# EAGLE design SAML10_DEV_2 (EAGLE 9.6.2)
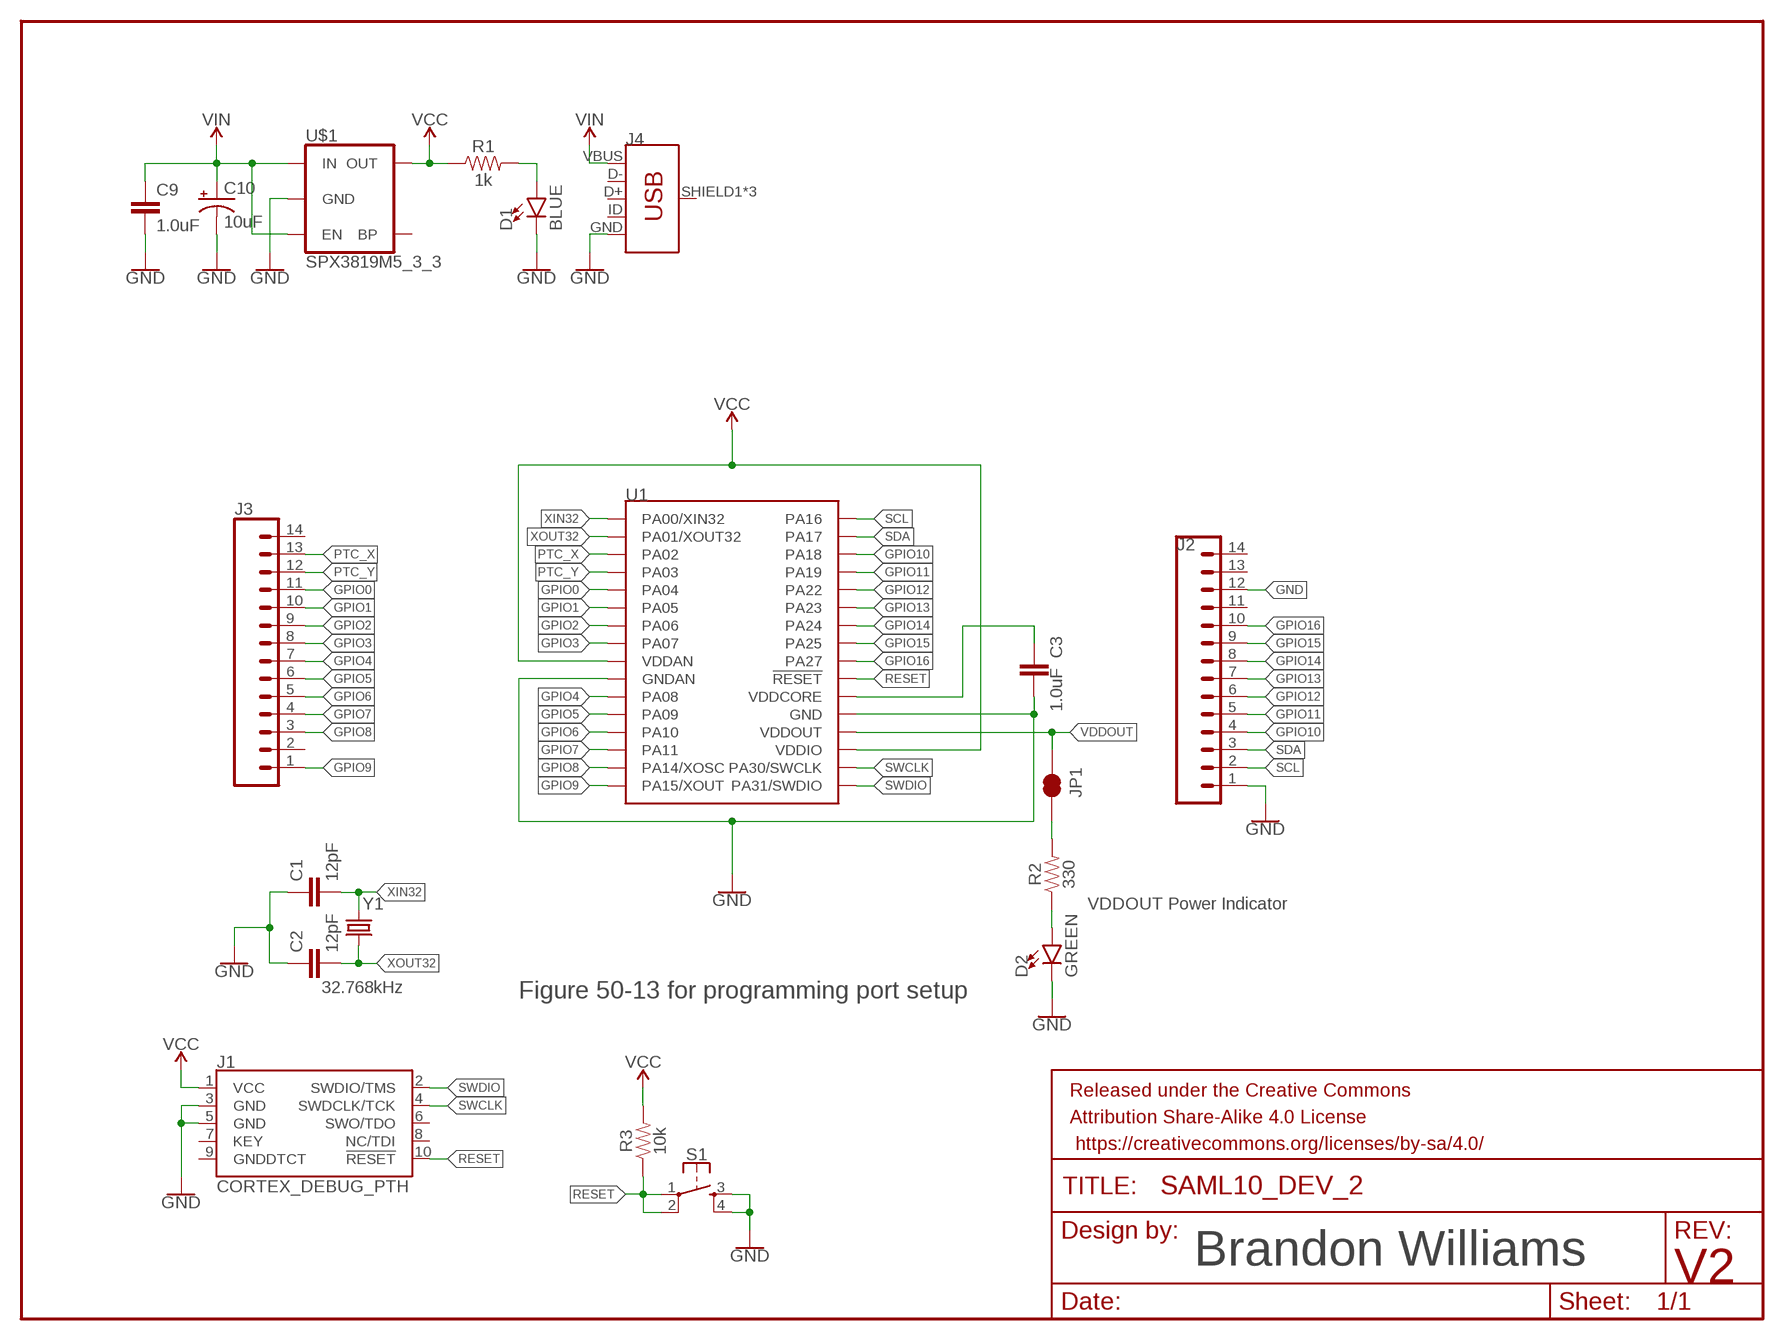
[diagram p0: schematic, sheet 1]

## Parts
C1  12pF  12PF-0603-50V-5%  [0603]
C2  12pF  12PF-0603-50V-5%  [0603]
C3  1.0uF  1.0UF-0603-16V-10%  [0603]
C9  1.0uF  1.0UF-0402-16V-10%  [0402]
C10  10uF  10UF-POLAR-0603-6.3V-20%(TANT)  [0603-POLAR]
D1  BLUE  LED-BLUE0603  [LED-0603]
D2  GREEN  LED-GREEN0603  [LED-0603]
FRAME1  FRAME-LETTERNO_PACKAGE  [DUMMY]
J1  CORTEX_DEBUG_PTH  [2X5-PTH-1.27MM]
J2  CONN_14  [1X14]
J3  CONN_14  [1X14]
J4  USB_MICRO-BREDUCED_PASTE  [USB-B-MICRO-SMD_RED_PASTE]
JP1  JUMPER-SMT_2_NC_TRACE_NO-SILK  [SMT-JUMPER_2_NC_TRACE_NO-SILK]
R1  1k  1KOHM-0603-1/10W-1%  [0603]
R2  330  330OHM-0603-1/10W-1%  [0603]
R3  10k  10KOHM-0603-1/10W-1%  [0603]
S1  MOMENTARY-SWITCH-SPST-2-SMD-4.6X2.8MM  [TACTILE_SWITCH_SMD_4.6X2.8MM]
U1  SAML10  [ATSAML10E15A-MU-ND]
U$1  SPX3819M5_3_3  V_REG_SPX3819-SOT23-5  [SOT23-5]
Y1  32.768kHz  CRYSTAL-32.768KHZSMD-3.2X1.5  [CRYSTAL-SMD-3.2X1.5MM]

## Nets
GND: C1.1 C2.1 C3.2 C9.2 C10.- D1.C D2.C J1.3(GND) J1.5(GND) J2.1 J2.12 J4.GND S1.3 S1.4 U1.P$10(GNDAN) U1.P$28(GND) U$1.2(GND)
GPIO0: J3.11 U1.P$5(PA04)
GPIO1: J3.10 U1.P$6(PA05)
GPIO2: J3.9 U1.P$7(PA06)
GPIO3: J3.8 U1.P$8(PA07)
GPIO4: J3.7 U1.P$11(PA08)
GPIO5: J3.6 U1.P$12(PA09)
GPIO6: J3.5 U1.P$13(PA10)
GPIO7: J3.4 U1.P$14(PA11)
GPIO8: J3.3 U1.P$15(PA14/XOSC)
GPIO9: J3.1 U1.P$16(PA15/XOUT)
GPIO10: J2.4 U1.P$19(PA18)
GPIO11: J2.5 U1.P$20(PA19)
GPIO12: J2.6 U1.P$21(PA22)
GPIO13: J2.7 U1.P$22(PA23)
GPIO14: J2.8 U1.P$23(PA24)
GPIO15: J2.9 U1.P$24(PA25)
GPIO16: J2.10 U1.P$25(PA27)
N$1: JP1.2 R2.2
N$2: D2.A R2.1
N$3: C3.1 U1.P$27(VDDCORE)
N$25: D1.A R1.2
PTC_X: J3.13 U1.P$3(PA02)
PTC_Y: J3.12 U1.P$4(PA03)
RESET: J1.10(!RESET) R3.1 S1.1 S1.2 U1.P$26(!RESET)
SCL: J2.2 U1.P$17(PA16)
SDA: J2.3 U1.P$18(PA17)
SWCLK: J1.4(SWDCLK/TCK) U1.P$31(PA30/SWCLK)
SWDIO: J1.2(SWDIO/TMS) U1.P$32(PA31/SWDIO)
VCC: J1.1(VCC) R1.1 R3.2 U1.P$9(VDDAN) U1.P$30(VDDIO) U$1.5(OUT)
VDDOUT: JP1.1 U1.P$29(VDDOUT)
VIN: C9.1 C10.+ J4.VBUS U$1.1(IN) U$1.3(EN)
XIN32: C1.2 U1.P$1(PA00/XIN32) Y1.P$1
XOUT32: C2.2 U1.P$2(PA01/XOUT32) Y1.P$2
Unconnected: J1.6(SWO/TDO) J1.7(KEY) J1.8(NC/TDI) J1.9(GNDDTCT) J2.11 J2.13 J2.14 J3.2 J3.14 J4.D+ J4.D- J4.ID J4.SHIELD1(SHIELD) J4.SHIELD2(SHIELD) J4.SHIELD3(SHIELD) U$1.4(BP)

## Notes on the sheet
- VDDOUT Power Indicator
- Figure 50-13 for programming port setup
- Brandon Williams
- V2

## Library data of the parts
C1 C2 = SparkFun-Capacitors:12PF: 12pF ceramic capacitors A capacitor is a passive two-terminal electrical component used to store electrical energy temporarily in an electric field.; PROD_ID: CAP-09137
C3 = SparkFun-Capacitors:1.0UF: 1µF ceramic capacitors A capacitor is a passive two-terminal electrical component used to store electrical energy temporarily in an electric field.; PROD_ID: CAP-00868
C9 = SparkFun-Capacitors:1.0UF: 1µF ceramic capacitors A capacitor is a passive two-terminal electrical component used to store electrical energy temporarily in an electric field.; PROD_ID: CAP-12417
C10 = SparkFun-Capacitors:10UF-POLAR: 10.0µF polarized capacitors A capacitor is a passive two-terminal electrical component used to store electrical energy temporarily in an electric field.; PROD_ID: CAP-13210
D1 = SparkFun-LED:LED-BLUE: Blue SMD LED Used in manufacturing of various products at SparkFun Packages: 0603 - SMD 0603 package [Product Link] <http://www.digikey.com/product-detail/en/SMLE12BC7TT86/511-1589-2-ND/1641808> 1206 - SMD1206 package [Product Link] <http://www.digikey.com/product-detail/en/lite-on-inc/LTST-C150TBKT/160-1643-1-ND/573584> SparkFun Products: ESP8266 Thing-Dev Board <https://www.sparkfun.com/products/13711> RedBoard <https://www.sparkfun.com/products/12757>; PROD_ID: DIO-08575
D2 = SparkFun-LED:LED-GREEN: Green SMD LED Used in manufacturing of various products at SparkFun Packages: 0603 - SMD 0603 package [Product Link] <http://www.futureelectronics.com/en/technologies/semiconductors/optoelectronics/leds/Pages/9894312-LTST-C190GKT.aspx?CrossPart=HSMG-C190&IM=0> LilyPad 1206 - SMD1206 LilyPad package [Product Link] <http://www.futureelectronics.com/en/Technologies/Product.aspx?ProductID=IN150NGHARVATEKCORPORATION2049943&IM=0> 1206 - SMD1206 package [Product Link] <http://www.futureelectronics.com/en/technologies/semiconductors/optoelectronics/leds/Pages/8315665-LTST-C150KGKT.aspx?IM=0> 1206 Bottom Mount -SMD 1206 Bottom Mount [Product Link] <http://www.digikey.com/product-detail/en/lite-on-inc/LTST-C230KGKT/160-1456-1-ND/386854> SparkFun Products: Pro Mini 328 -5V <https://www.sparkfun.com/products/821> RedBoard <https://www.sparkfun.com/products/12757> MP3 Trigger <https://www.sparkfun.com/products/13720> Makey Makey <https://www.sparkfun.com/products/11076>; PROD_ID: DIO-00821
FRAME1 = SparkFun-Aesthetics:FRAME-LETTER: Schematic Frame - Letter Standard 8.5x11 US Letter frame; DESIGNER: Nobody; VERSION: v01
J1 = SparkFun-Connectors:CORTEX_DEBUG: Cortex Debug Connector - 10 pin Supports JTAG debug, Serial Wire debug, and Serial Wire Viewer. PTH and SMD connector options available. General Connector Information <http://infocenter.arm.com/help/topic/com.arm.doc.faqs/attached/13634/cortex_debug_connectors.pdf> Products: PTH Connector <http://www.digikey.com/product-detail/en/cnc-tech/3220-10-0100-00/1175-1627-ND/3883661> -via Digi-Key SparkFun PSoc <https://www.sparkfun.com/products/13229> SparkFun T <https://www.sparkfun.com/products/13810>
J2 J3 = SparkFun-Connectors:CONN_14: Multi connection point. Often used as Generic Header-pin footprint for 0.1 inch spaced/style header connections On any of the 0.1 inch spaced packages, you can populate with these: Break Away Headers - Straight <https://www.sparkfun.com/products/116> (PRT-00116) Break Away Male Headers - Right Angle <https://www.sparkfun.com/products/553> (PRT-00553) Female Headers <https://www.sparkfun.com/products/115> (PRT-00115) Break Away Headers - Machine Pin <https://www.sparkfun.com/products/117> (PRT-00117) Break Away Female Headers - Swiss Machine Pin <https://www.sparkfun.com/products/743> (PRT-00743) For SCREWTERMINALS and SPRING TERMINALS visit here: Screw Terimnals on SparkFun.com <https://www.sparkfun.com/search/results?term=Screw+Terminals> (5mm/3.5mm/2.54mm spacing) This device is also useful as a general connection point to wire up your design to another part of your project. Our various solder wires solder well into these plated through hole pads. Hook-Up Wire - Assortment (Stranded, 22 AWG) <https://www.sparkfun.com/products/11375> (PRT-11375) Hook-Up Wire - Assortment (Solid Core, 22 AWG) <https://www.sparkfun.com/products/11367> (PRT-11367) View the entire wire category on our website here <https://www.sparkfun.com/categories/141> Special notes: Molex polarized connector foot print use with SKU : PRT-08231 with associated crimp pins and housings. 1MM SMD Version SKU: PRT-10208 NOTES ON THE VARIANTS LOCK and LOCK_LONGPADS... This footprint was designed to help hold the alignment of a through-hole component (i.e. 6-pin header) while soldering it into place. You may notice that each hole has been shifted either up or down by 0.005 of an inch from it's more standard position (which is a perfectly straight line). This slight alteration caused the pins (the squares in the middle) to touch the edges of the holes. Because they are alternating, it causes a "brace" to hold the component in place. 0.005 has proven to be the perfect amount of "off-center" position when using our standard breakaway headers. Although looks a little odd when you look at the bare footprint, once you have a header in there, the alteration is very hard to notice. Also,if you push a header all the way into place, it is covered up entirely on the bottom side.
J4 = SparkFun-Connectors:USB_MICRO-B: USB Type Micro-B Connector Male/female and PTH/SMT variants SparkFun Products: SparkFun microB USB Breakout <https://www.sparkfun.com/products/12035> SparkFun USB microB Plug Breakout <https://www.sparkfun.com/products/10031> SparkFun ESP8266 Thing <https://www.sparkfun.com/products/13231>; PROD_ID: CONN-11752
JP1 = SparkFun-Jumpers:JUMPER-SMT_2_NC_TRACE: Normally closed trace jumper This jumper has a trace between two pads so it's normally closed (NC). Use a razor knife to open the connection. For best results follow the IPC guidelines for cutting traces: Cutout at least 0.063 mm (0.005 in). Remove all loose material to clean up the cut area. Seal the cut with an approved epoxy. Reapply solder to reclose the connection.
R1 = SparkFun-Resistors:1KOHM: 1kΩ resistor A resistor is a passive two-terminal electrical component that implements electrical resistance as a circuit element. Resistors act to reduce current flow, and, at the same time, act to lower voltage levels within circuits. - Wikipedia; PROD_ID: RES-07856
R2 = SparkFun-Resistors:330OHM: 330Ω resistor A resistor is a passive two-terminal electrical component that implements electrical resistance as a circuit element. Resistors act to reduce current flow, and, at the same time, act to lower voltage levels within circuits. - Wikipedia; PROD_ID: RES-00818
R3 = SparkFun-Resistors:10KOHM: 10kΩ resistor A resistor is a passive two-terminal electrical component that implements electrical resistance as a circuit element. Resistors act to reduce current flow, and, at the same time, act to lower voltage levels within circuits. - Wikipedia; PROD_ID: RES-00824
S1 = SparkFun-Switches:MOMENTARY-SWITCH-SPST-2: Momentary Switch (Pushbutton) - SPST - Two Circuits Normally-open (NO) SPST momentary switches (buttons, pushbuttons). Schematic symbol includes two switch circuits. Variants SMD-4.6MMX2.8MM - 4.60mm x 2.80mm Tactile Momentary Button Switch - Used on SparkFun SAMD21 Mini Breakout <https://www.sparkfun.com/products/13664> SMD-5.2MM - Mini Pushbutton Switch - SMD <https://www.sparkfun.com/products/8720> - Used on Arduino Pro Mini <https://www.sparkfun.com/products/11114>; PROD_ID: SWCH-13065
U1 = ARM_Cortex_23:SAML10
U$1 = SparkFun-IC-Power:V_REG_SPX3819: SPX3819 Voltage Regulator 3.3V 500mA, 16V input Datasheet <https://www.exar.com/content/document.ashx?id=22106> SparkFun Products: SparkFun Serial Controlled Motor Driver <https://www.sparkfun.com/products/13911>; PROD_ID: VREG-13321
Y1 = SparkFun-Clocks:CRYSTAL-32.768KHZ: 32.768kHz Crystal Frequency: 32.768kHz Frequency Stability: ±20ppm Load Capacitance: 12.5pF (PTH-2X6 & SMD-3.2X1.5), 6pF (SMD-2X6) SparkFun Products: SparkFun BigTime Watch Kit <https://www.sparkfun.com/products/11734> SparkFun nRF52832 Breakout <https://www.sparkfun.com/products/13990> SparkFun Real Time Clock Module <https://www.sparkfun.com/products/12708>; PROD_ID: XTAL-13062

## Board
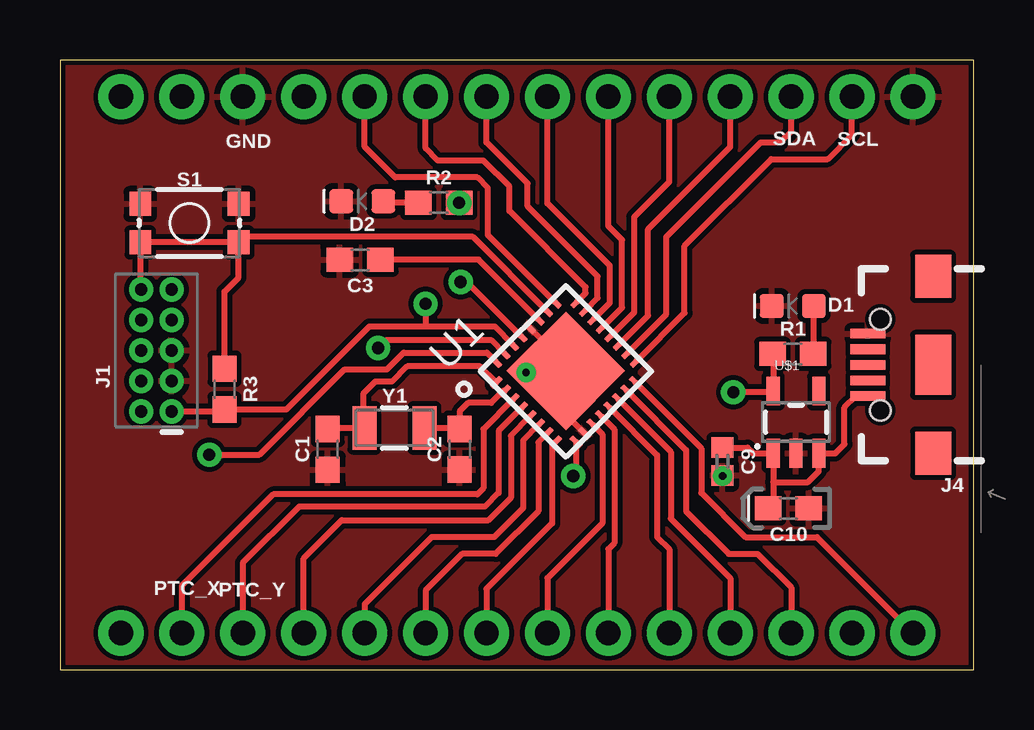
[diagram p1: board, top side]
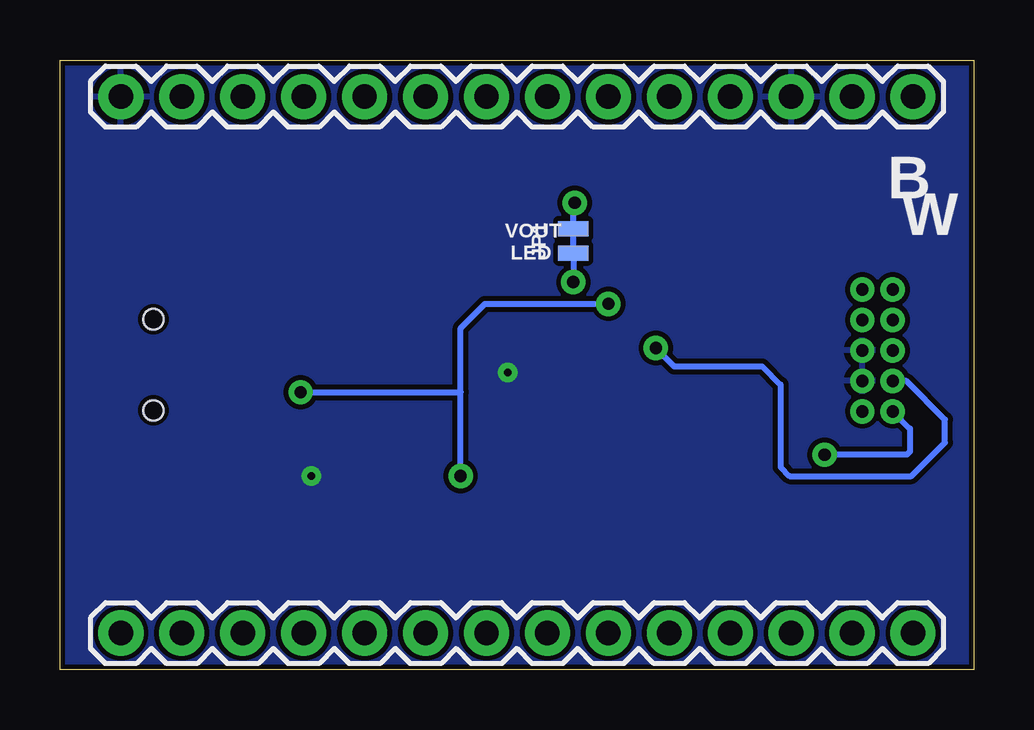
[diagram p2: board, bottom side, seen from below]

Size 38.1 x 25.4 mm. Coordinates in mm from the lower left corner, seen from the top.
Outline: 0,0 38.1,0 38.1,25.4 0,25.4 0,0
Copper layers (1*16): Top 0.035mm / dielectric 1.5mm / Bottom 0.035mm
Design rules "SparkFun-2-layer-STANDARD *": minimum track width 10mil, minimum drill 20mil, track to track 8mil, track to pad 8mil, pad to pad 8mil, via to via 10mil, smd to smd 8mil, copper to edge 8mil, drill to drill 8mil, minimum pad ring 10mil, minimum via ring 10mil, stop-mask expansion 4mil, vias tented up to drill 25mil, thermal gap 10mil

### Footprints (pad centres in the part's own frame; a part is rotated, then mirrored left to right if it is on the bottom)
0603 = smd 1.1 x 1: 1 -0.85,0; 2 0.85,0
0402 = smd 0.85 x 0.9: 1 -0.58,0; 2 0.58,0
0603-POLAR = smd 1.1 x 1: + 0.85,0; - -0.85,0
LED-0603 = smd 1 x 1: A -0.877,0; C 0.877,0
2X5-PTH-1.27MM = drill 0.508 pad 1: 1 -2.54,-0.635; 2 -2.54,0.635; 3 -1.27,-0.635; 4 -1.27,0.635; 5 0,-0.635; 6 0,0.635; 7 1.27,-0.635; 8 1.27,0.635; 9 2.54,-0.635; 10 2.54,0.635
1X14 = drill 1.016 pad 1.88: 1 0,0; 2 2.54,0; 3 5.08,0; 4 7.62,0; 5 10.16,0; 6 12.7,0; 7 15.24,0; 8 17.78,0; 9 20.32,0; 10 22.86,0; 11 25.4,0; 12 27.94,0; 13 30.48,0; 14 33.02,0
USB-B-MICRO-SMD_RED_PASTE = smd 1.45 x 0.4: D+ 2.725,0; D- 2.725,0.65; GND 2.725,-1.3; ID 2.725,-0.65; VBUS 2.725,1.3 | smd 1.5 x 1.8: SHIELD1 0,3.685; SHIELD2 0,-3.685 | smd 1.5 x 2.5: SHIELD3 0,0 | hole 0.85: 2.2,1.9; 2.2,-1.9
SMT-JUMPER_2_NC_TRACE_NO-SILK = smd 0.635 x 1.27: 1 -0.508,0; 2 0.508,0
TACTILE_SWITCH_SMD_4.6X2.8MM = smd 0.9 x 1: 1 -2.05,-0.8; 2 2.05,-0.8; 3 2.05,0.8; 4 -2.05,0.8
ATSAML10E15A-MU-ND = smd 0.6 x 0.25: P$1 0.15,4.25; P$2 0.15,3.75; P$3 0.15,3.25; P$4 0.15,2.75; P$5 0.15,2.25; P$6 0.15,1.75; P$7 0.15,1.25; P$8 0.15,0.75; P$17 4.9,0.75; P$18 4.9,1.25; P$19 4.9,1.75; P$20 4.9,2.25; P$21 4.9,2.75; P$22 4.9,3.25; P$23 4.9,3.75; P$24 4.9,4.25 | smd 0.25 x 0.6: P$9 0.75,0.15; P$10 1.25,0.15; P$11 1.75,0.15; P$12 2.25,0.15; P$13 2.75,0.15; P$14 3.25,0.15; P$15 3.75,0.15; P$16 4.25,0.15; P$25 4.25,4.88; P$26 3.75,4.88; P$27 3.25,4.88; P$28 2.75,4.88; P$29 2.25,4.88; P$30 1.75,4.88; P$31 1.25,4.88; P$32 0.75,4.88 | smd 3.5 x 3.5: P$33 2.54,2.54
SOT23-5 = smd 0.55 x 1.2: 1 -0.95,-1.3; 2 0,-1.3; 3 0.95,-1.3; 4 0.95,1.3; 5 -0.95,1.3
CRYSTAL-SMD-3.2X1.5MM = smd 1 x 1.8: P$1 -1.25,0; P$2 1.25,0

### Placement (x,y rotation side)
C1  11.16,9.18 90 top
C2  16.66,9.18 90 top
C3  12.51,17.08 180 top
C9  27.61,8.67 270 top
C10  30.37,6.72 180 top
D1  30.55,15.15 180 top
D2  12.6,19.51 180 top
FRAME1  0.02,0.01 0 top
J1  4.02,13.3 90 top
J2  35.56,23.88 0 bottom
J3  35.56,1.52 0 bottom
J4  36.4,12.7 180 top
JP1  16.7,17.86 90 bottom
R1  30.55,13.15 0 top
R2  15.79,19.45 0 top
R3  6.86,11.68 270 top
S1  5.4,18.61 0 top
U1  21.09,8.85 45 top
U$1  30.68,10.31 0 top
Y1  13.95,10.07 0 top

### Tracks (layer width: path | path; a pad name or v marks a point on that pad's centre or on a via)
GND  (via drill 0.3)
  Top 0.254: U1.P$28 20.07,13.76 20.07,13.02 v19.43,12.38 19.43,12.28 U1.P$10
  other vias: 27.62,8.06
  pour Top: 0,25.59 0,0 38.22,0 38.22,25.59
  pour Bottom: 0,25.59 0,0 38.16,0 38.16,25.59
GPIO0
  Top 0.254: J3.11 10.16,4.64 11.75,6.22 17.86,6.22 18.8,7.16 18.8,9.74 U1.P$5
GPIO1
  Top 0.254: U1.P$6 19.3,9.54 19.3,6.73 18.1,5.52 15.49,5.52 12.7,2.73 J3.10
GPIO2
  Top 0.254: U1.P$7 19.94,9.47 19.94,6.6 18.16,4.83 16.76,4.83 15.24,3.3 J3.9
GPIO3
  Top 0.254: U1.P$8 20.51,9.34 20.51,6.1 17.78,3.37 J3.8
GPIO4
  Top 0.254: U1.P$11 22.61,9.81 22.61,6.1 20.32,3.81 J3.7
GPIO5
  Top 0.254: U1.P$12 23.11,10.01 23.11,5.27 22.86,5.02 J3.6
GPIO6
  Top 0.254: U1.P$13 24.89,8.94 24.89,5.52 25.4,5.02 J3.5
GPIO7
  Top 0.254: U1.P$14 25.46,9.07 25.46,6.29 27.94,3.81 J3.4
GPIO8
  Top 0.254: U1.P$15 26.1,9.14 26.1,6.6 27.88,4.83 29.08,4.83 30.48,3.43 J3.3
GPIO9
  Top 0.254: U1.P$16 26.73,9.22 26.73,7.37 28.57,5.52 31.56,5.52 J3.1
GPIO10
  Top 0.254: U1.P$19 24.51,14.75 24.51,18.35 27.94,21.78 J2.4
GPIO11
  Top 0.254: U1.P$20 23.94,14.89 23.94,18.86 25.4,20.32 J2.5
GPIO12
  Top 0.254: U1.P$21 23.43,15.09 23.43,17.91 22.86,18.48 J2.6
GPIO13
  Top 0.254: U1.P$22 22.92,15.29 22.92,16.83 20.32,19.43 J2.7
GPIO14
  Top 0.254: U1.P$23 22.42,15.48 22.42,16.38 19.49,19.3 19.49,20.26 17.78,21.97 J2.8
GPIO15
  Top 0.254: U1.P$24 21.91,15.68 21.91,15.94 18.73,19.11 18.73,20.13 17.65,21.21 15.75,21.21 15.24,21.72 J2.9
GPIO16
  Top 0.254: U1.P$25 17.84,18.11 17.84,20.07 17.4,20.51 13.97,20.51 12.7,21.78 J2.10
N$1  (via drill 0.51)
  Bottom 0.254: JP1.2 16.7,19.39 R2.2
  other vias: 16.64,19.45
N$2
  Top 0.254: R2.1 13.54,19.45 D2.A
N$3
  Top 0.254: U1.P$27 17.45,17.08 C3.1
N$25
  Top 0.254: R1.2 31.43,13.18 D1.A
PTC_X
  Top 0.254: U1.P$3 17.65,10.02 17.65,7.56 17.4,7.3 8.89,7.3 5.08,3.49 J3.13
PTC_Y
  Top 0.254: U1.P$4 18.29,9.94 18.29,7.37 17.72,6.79 9.97,6.79 7.62,4.45 J3.12
RESET
  Top 0.254: U1.P$26 17.21,18.03 7.68,18.03 S1.2 | S1.2 S1.1 3.35,15.87 J1.10 | R3.1 6.86,15.75 7.45,16.34 S1.2
SCL
  Top 0.254: U1.P$17 26.04,14.86 26.04,17.65 29.65,21.27 32,21.27 33.02,22.29 J2.2
SDA
  Top 0.254: U1.P$18 25.27,14.81 25.27,18.03 29.21,21.97 30.04,21.97 30.48,22.42 J2.3
SWCLK  (via drill 0.51)
  Top 0.254: U1.P$31 17.99,13.72 13.58,13.72 v13.26,13.4
  Bottom 0.254: v13.26,13.4 12.5,12.64 8.83,12.64 8.06,11.87 8.06,8.45 7.68,8.06 2.6,8.06 1.21,9.46 1.21,10.41 2.82,12.03 J1.4
SWDIO  (via drill 0.51)
  Top 0.254: v6.22,8.95 8.32,8.95 11.87,12.51 13.63,12.51 14.32,13.21 17.79,13.21 U1.P$32
  Bottom 0.254: J1.2 2.67,10.04 2.67,9.08 2.79,8.95 v6.22,8.95
VCC  (via drill 0.51)
  Top 0.254: J1.1 6.78,10.76 R3.2 9.44,10.83 12.89,14.29 15.24,14.29 | U1.P$30 18.13,14.29 15.24,14.29 | U1.P$9 21.51,8.18 v21.4,8.06 | v15.24,15.24 15.24,14.29 | R1.1 29.73,13.12 U$1.5 29.68,11.56 v28.07,11.56
  Bottom 0.254: v21.4,8.06 21.4,11.56 | 21.4,11.56 21.4,14.22 20.38,15.24 v15.24,15.24 | v28.07,11.56 21.4,11.56
VDDOUT  (via drill 0.51)
  Top 0.254: U1.P$29 16.98,16.15 v16.7,16.15
  Bottom 0.254: JP1.1 v16.7,16.15
VIN
  Top 0.254: J4.VBUS 33.18,11.4 32.7,10.92 32.7,9.4 32.31,9.01 U$1.3 31.63,8.26 31.18,7.81 29.73,7.81 | 29.73,7.81 U$1.1 28.9,9.01 28.66,9.25 C9.1 | 29.73,7.81 29.73,6.93 C10.+
XIN32
  Top 0.254: C1.2 11.21,10.07 Y1.P$1 12.64,10.13 12.64,11.49 13.14,12 13.84,12 14.47,12.64 17.52,12.64 U1.P$1
XOUT32
  Top 0.254: Y1.P$2 16.63,10.07 C2.2 16.66,10.76 17.02,11.11 17.97,11.11 18.47,11.61 U1.P$2

### Text on the board
tPlace: GND | SDA | SCL | PTC_X | PTC_Y
bPlace: B | W | VOUT / LED